# EAGLE design M651A (EAGLE 6.6.0)
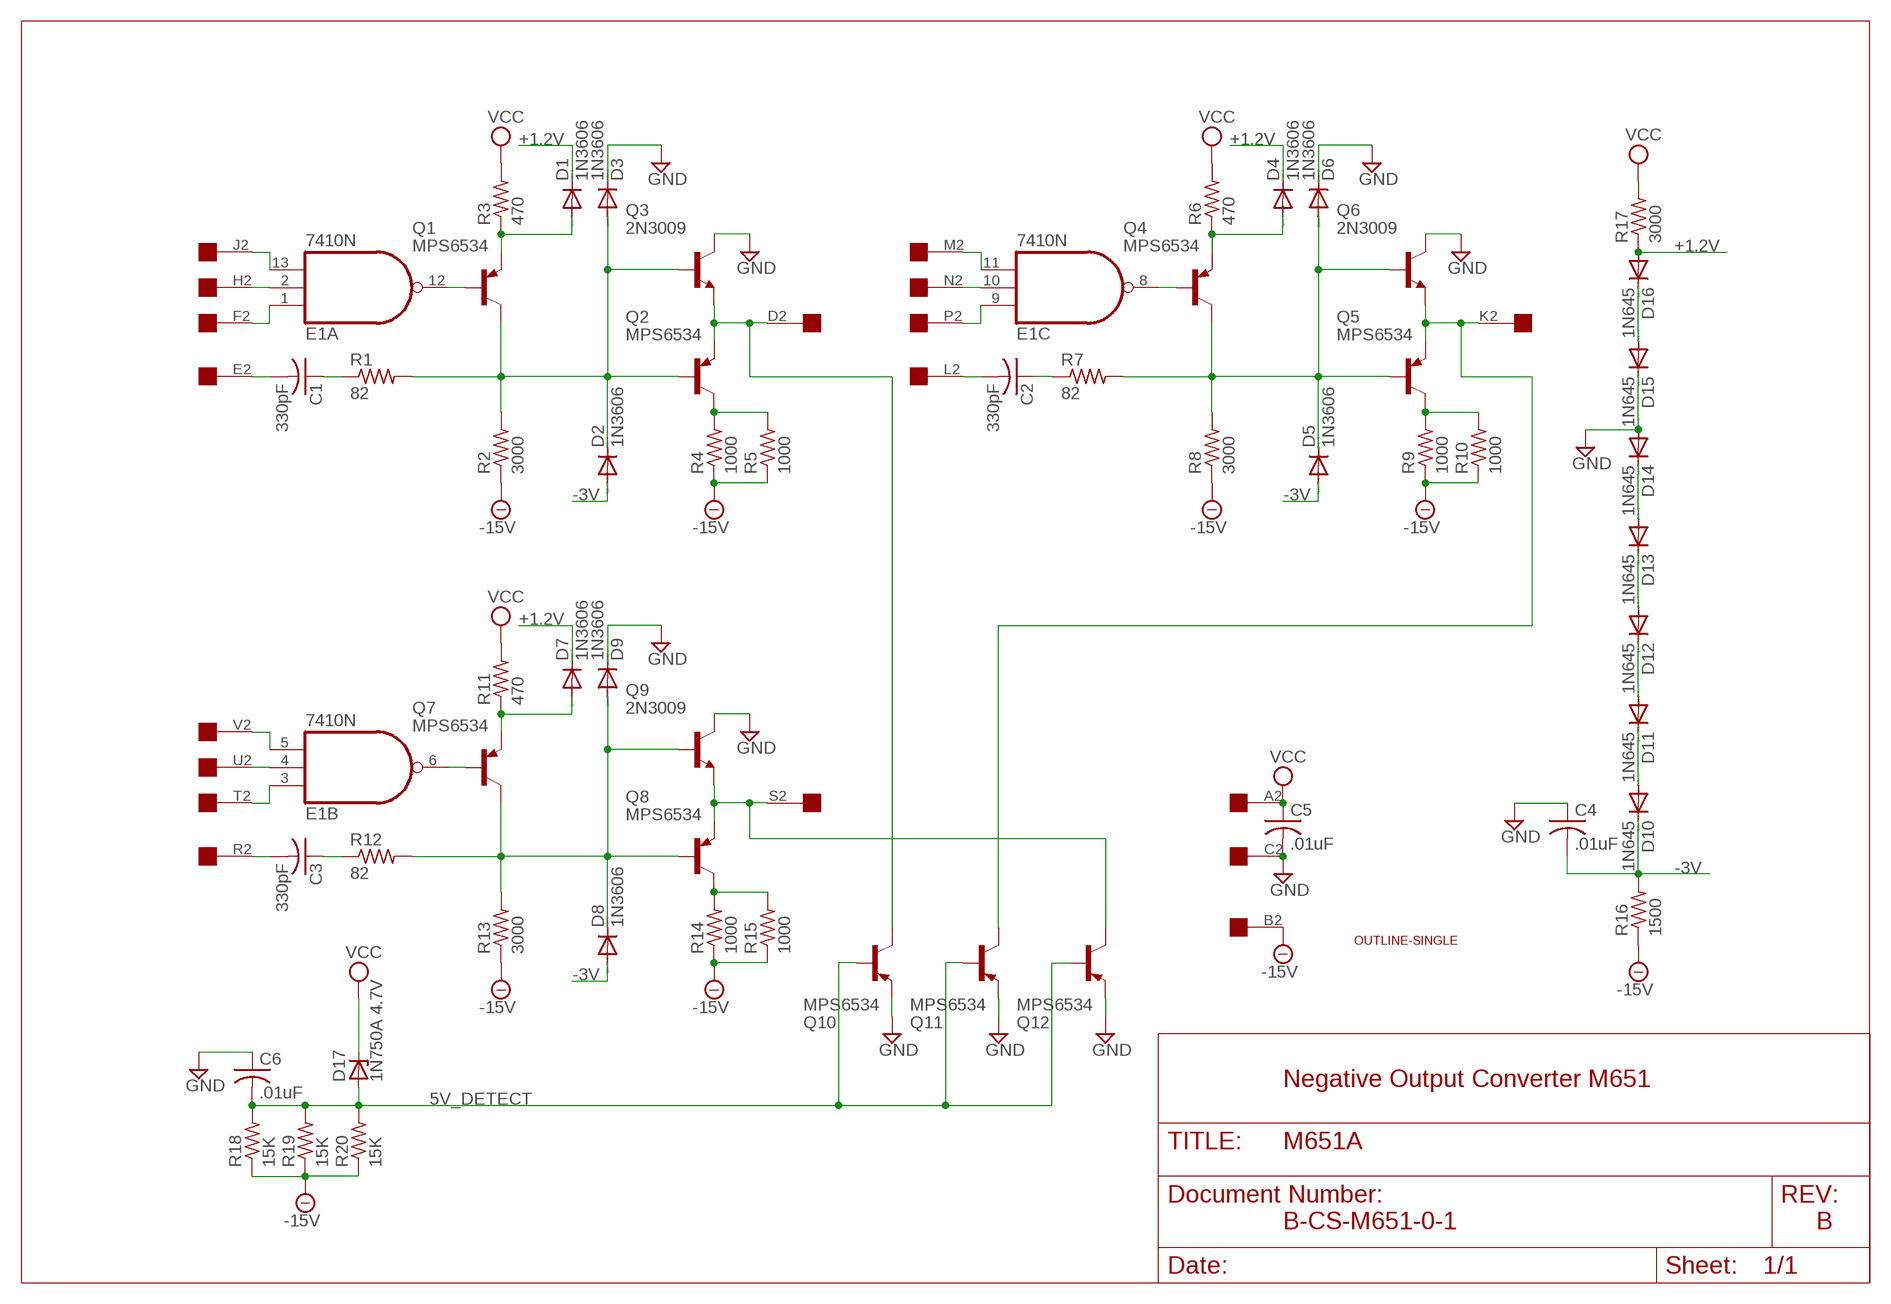
[diagram p0: schematic, sheet 1]

## Parts
C1  330pF  C-US050-025X075  [C050-025X075]
C2  330pF  C-US050-025X075  [C050-025X075]
C3  330pF  C-US050-025X075  [C050-025X075]
C4  .01uF  C-US050-025X075  [C050-025X075]
C5  .01uF  C-US050-025X075  [C050-025X075]
C6  .01uF  C-US050-025X075  [C050-025X075]
D1  1N3606  1N4148DO35-10  [DO35-10]
D2  1N3606  1N4148DO35-10  [DO35-10]
D3  1N3606  1N4148DO35-10  [DO35-10]
D4  1N3606  1N4148DO35-10  [DO35-10]
D5  1N3606  1N4148DO35-10  [DO35-10]
D6  1N3606  1N4148DO35-10  [DO35-10]
D7  1N3606  1N4148DO35-10  [DO35-10]
D8  1N3606  1N4148DO35-10  [DO35-10]
D9  1N3606  1N4148DO35-10  [DO35-10]
D10  1N645  1N4148DO35-10  [DO35-10]
D11  1N645  1N4148DO35-10  [DO35-10]
D12  1N645  1N4148DO35-10  [DO35-10]
D13  1N645  1N4148DO35-10  [DO35-10]
D14  1N645  1N4148DO35-10  [DO35-10]
D15  1N645  1N4148DO35-10  [DO35-10]
D16  1N645  1N4148DO35-10  [DO35-10]
D17  1N750A 4.7V  ZENER-DIODEDO35Z10  [DO35Z10]
E1  7410N  [DIL14]
Q1  MPS6534  2N5415  [TO39]
Q2  MPS6534  2N5415  [TO39]
Q3  2N3009  2N2219  [TO5]
Q4  MPS6534  2N5415  [TO39]
Q5  MPS6534  2N5415  [TO39]
Q6  2N3009  2N2219  [TO5]
Q7  MPS6534  2N5415  [TO39]
Q8  MPS6534  2N5415  [TO39]
Q9  2N3009  2N2219  [TO5]
Q10  MPS6534  2N5415  [TO39]
Q11  MPS6534  2N5415  [TO39]
Q12  MPS6534  2N5415  [TO39]
R1  82  R-US_0207/10  [0207/10]
R2  3000  R-US_0207/10  [0207/10]
R3  470  R-US_0207/10  [0207/10]
R4  1000  R-US_0207/10  [0207/10]
R5  1000  R-US_0207/10  [0207/10]
R6  470  R-US_0207/10  [0207/10]
R7  82  R-US_0207/10  [0207/10]
R8  3000  R-US_0207/10  [0207/10]
R9  1000  R-US_0207/10  [0207/10]
R10  1000  R-US_0207/10  [0207/10]
R11  470  R-US_0207/10  [0207/10]
R12  82  R-US_0207/10  [0207/10]
R13  3000  R-US_0207/10  [0207/10]
R14  1000  R-US_0207/10  [0207/10]
R15  1000  R-US_0207/10  [0207/10]
R16  1500  R-US_0207/10  [0207/10]
R17  3000  R-US_0207/10  [0207/10]
R18  15K  R-US_0207/10  [0207/10]
R19  15K  R-US_0207/10  [0207/10]
R20  15K  R-US_0207/10  [0207/10]
U$1  OUTLINE-SINGLE  [SINGLE]
U$3  EDGE-1  [EDGE-CON1]

## Nets
5V_DETECT: C6.2 D17.A Q10.2(B) Q11.2(B) Q12.2(B) R18.2 R19.2 R20.2
+1.2V [Supply]: D1.C D4.C D7.C D16.A R17.1
-3V [Supply]: C4.2 D2.A D5.A D8.A D10.C R16.2
-15V: R2.1 R4.1 R5.1 R8.1 R9.1 R10.1 R13.1 R14.1 R15.1 R16.1 R18.1 R19.1 R20.1 U$3.B2
GND [Supply]: C4.1 C5.2 C6.1 D3.C D6.C D9.C D14.A D15.C Q3.3(C) Q6.3(C) Q9.3(C) Q10.1(E) Q11.1(E) Q12.1(E) U$3.C2
N$1: E1.2(A:I1) U$3.H2
N$2: C1.2 U$3.E2
N$3: C1.1 R1.1
N$4: E1.12(A:O) Q1.2(B)
N$5: D1.A Q1.1(E) R3.1
N$6: D2.C D3.A Q1.3(C) Q2.2(B) Q3.2(B) R1.2 R2.2
N$7: Q2.1(E) Q3.1(E) Q10.3(C) U$3.D2
N$8: Q2.3(C) R4.2 R5.2
N$9: E1.9(C:I0) U$3.P2
N$10: E1.11(C:I2) U$3.M2
N$11: E1.10(C:I1) U$3.N2
N$12: E1.8(C:O) Q4.2(B)
N$13: D4.A Q4.1(E) R6.1
N$14: E1.1(A:I0) U$3.F2
N$15: E1.13(A:I2) U$3.J2
N$16: C2.2 U$3.L2
N$17: C2.1 R7.1
N$18: D5.C D6.A Q4.3(C) Q5.2(B) Q6.2(B) R7.2 R8.2
N$19: Q5.1(E) Q6.1(E) Q11.3(C) U$3.K2
N$20: Q5.3(C) R9.2 R10.2
N$21: E1.3(B:I0) U$3.T2
N$22: E1.5(B:I2) U$3.V2
N$23: E1.4(B:I1) U$3.U2
N$24: E1.6(B:O) Q7.2(B)
N$25: D7.A Q7.1(E) R11.1
N$26: C3.2 U$3.R2
N$27: C3.1 R12.1
N$28: D8.C D9.A Q7.3(C) Q8.2(B) Q9.2(B) R12.2 R13.2
N$29: Q8.1(E) Q9.1(E) Q12.3(C) U$3.S2
N$30: Q8.3(C) R14.2 R15.2
N$32 [Supply]: D10.A D11.C
N$33 [Supply]: D11.A D12.C
N$34 [Supply]: D12.A D13.C
N$35 [Supply]: D13.A D14.C
N$37 [Supply]: D15.A D16.C
VCC [Supply]: C5.1 D17.C R3.2 R6.2 R11.2 R17.2 U$3.A2

## Notes on the sheet
- Negative Output Converter M651
- B-CS-M651-0-1 | B

## Power pins joined to a net without a drawn wire
GND: E1.7(P:GND)
VCC: E1.14(P:VCC)

## Library data of the parts
C1-C6 = rcl:C-US: CAPACITOR, American symbol
D1-D16 = diode:1N4148: DIODE high speed (Philips)
D17 = diode:ZENER-DIODE: Z-Diode
E1 = 74xx-us:74*10: Triple 3-input NAND gate
Q1 Q2 Q4 Q5 Q7 Q8 Q10-Q12 = transistor-pnp:2N5415*: PNP Transistror
Q3 Q6 Q9 = transistor-npn:2N2219: NPN Transistor
R1-R20 = rcl:R-US_: RESISTOR, American symbol
U$1 = dec-con:OUTLINE-*: Board outlines for DEC boards.
U$3 = dec-con:EDGE-1: Single-Sided DEC Edge Connector -- (side 2)

## Net classes
1 Supply: width 0.813 mm

## Board
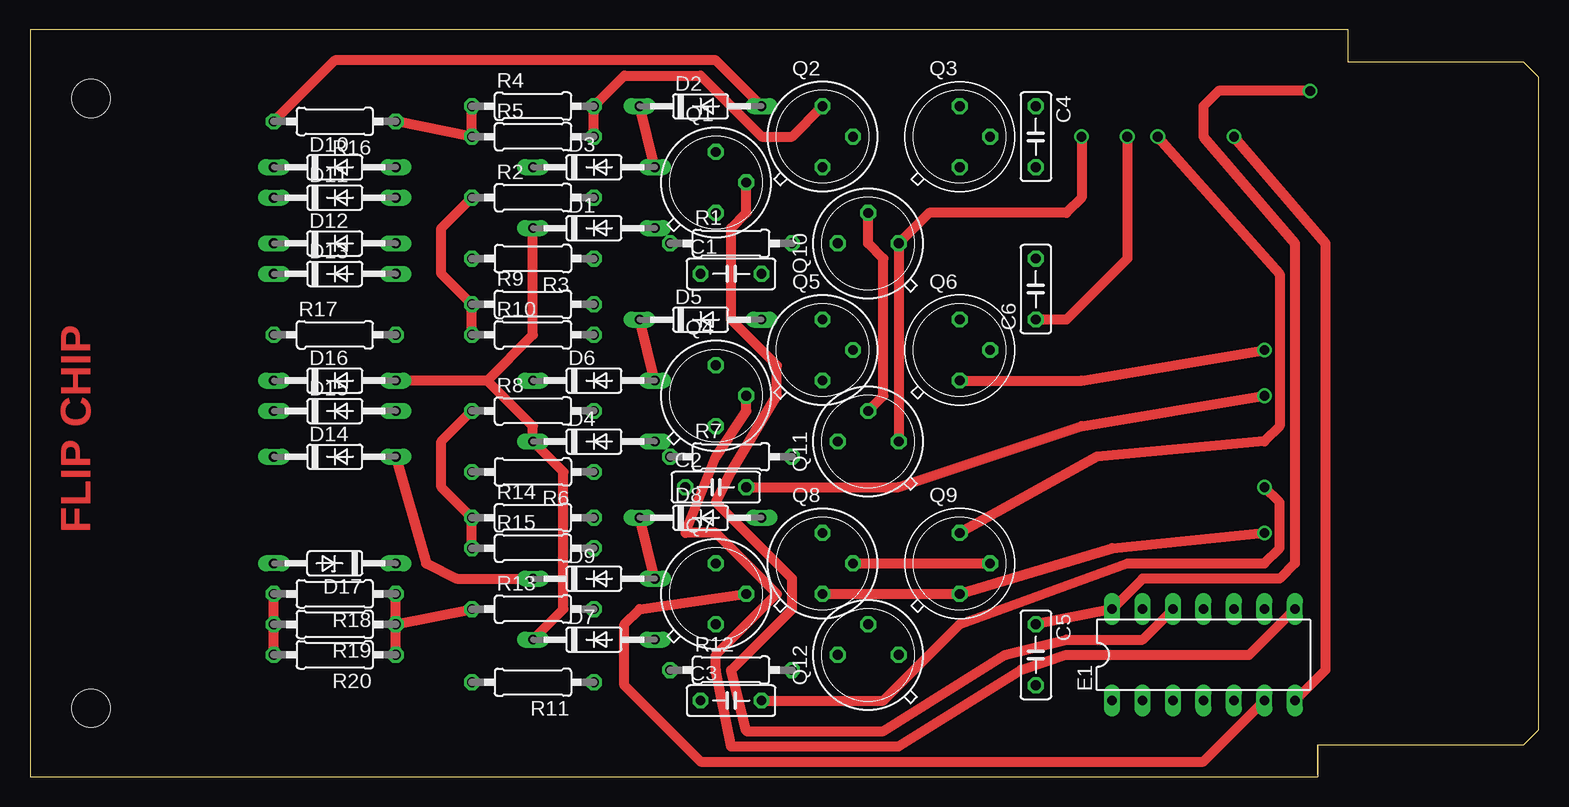
[diagram p1: board, top side]
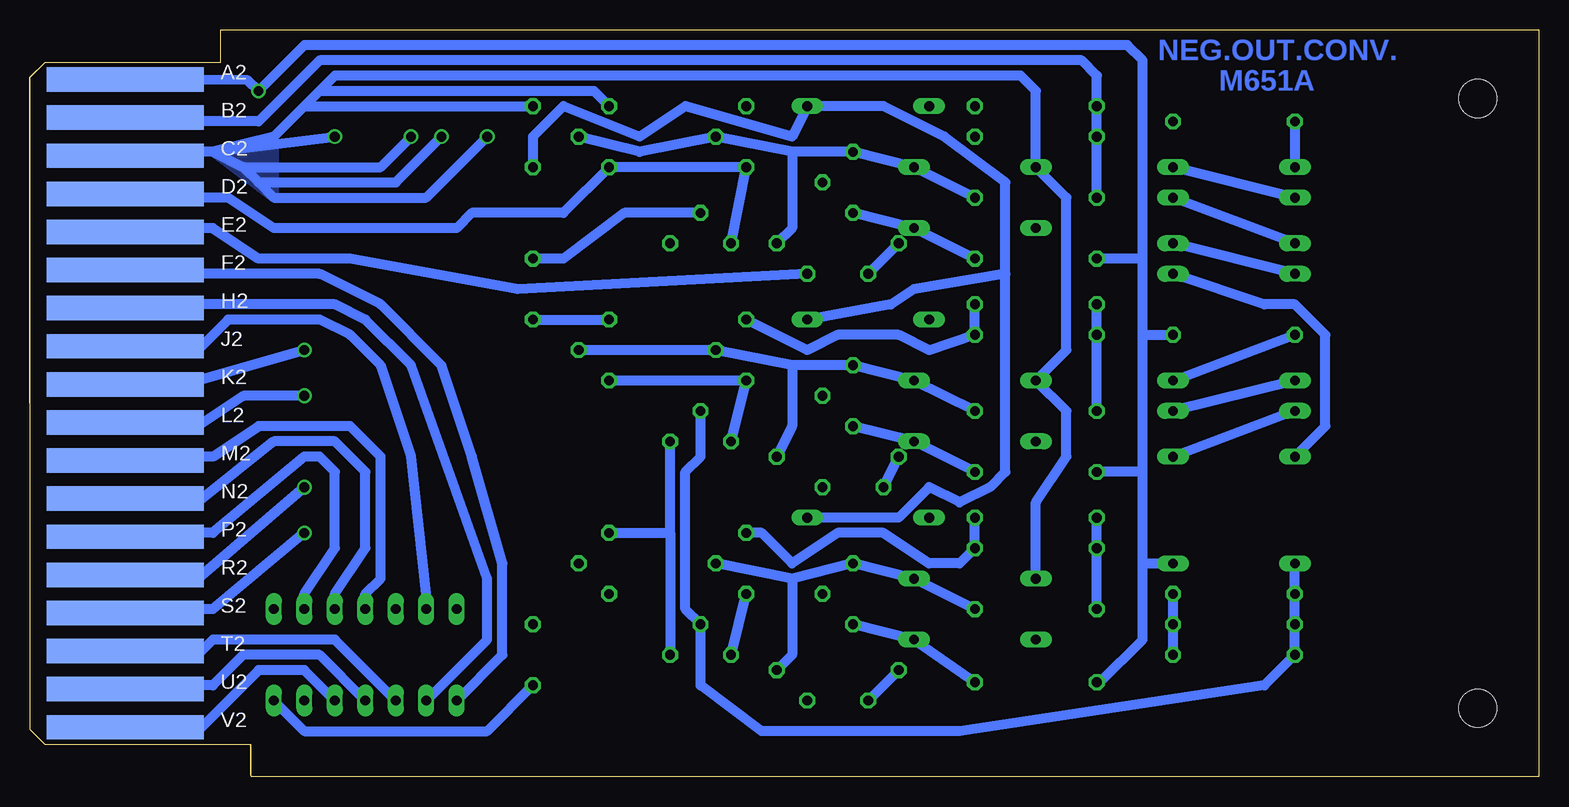
[diagram p2: board, bottom side, seen from below]

Size 125.73 x 62.23 mm. Coordinates in mm from the lower left corner, seen from the top.
Copper layers (1+16): Top 0.035mm / dielectric 1.5mm / Bottom 0.035mm
Design rules "16mils": minimum track width 16mil, minimum drill 32mil, track to track 15mil, track to pad 10mil, pad to pad 10mil, via to via 10mil, smd to smd 10mil, copper to edge 13mil, drill to drill 10mil, minimum pad ring 10mil, minimum via ring 8mil, stop-mask expansion 0mil, vias tented up to drill 0mil, thermal gap 10mil

### Footprints (pad centres in the part's own frame; a part is rotated, then mirrored left to right if it is on the bottom)
C050-025X075 = drill 0.813 octagon: 1 -2.54,0; 2 2.54,0
DO35-10 = drill 0.813 long: A 5.08,0; C -5.08,0
DO35Z10 = drill 0.813 long: A 5.08,0; C -5.08,0
DIL14 = drill 0.813 long: 1 -7.62,-3.81; 2 -5.08,-3.81; 3 -2.54,-3.81; 4 0,-3.81; 5 2.54,-3.81; 6 5.08,-3.81; 7 7.62,-3.81; 8 7.62,3.81; 9 5.08,3.81; 10 2.54,3.81; 11 0,3.81; 12 -2.54,3.81; 13 -5.08,3.81; 14 -7.62,3.81
TO39 = drill 0.813 octagon: 1 0,-2.54; 2 2.54,0; 3 0,2.54
TO5 = drill 0.813 octagon: 1 0,-2.54; 2 2.54,0; 3 0,2.54
0207/10 = drill 0.813 octagon: 1 -5.08,0; 2 5.08,0
SINGLE = hole 3.175: 120.65,56.515; 120.65,5.715
EDGE-CON1 = smd 13.106 x 2.032 bottom: A2 7.938,4.128; B2 7.938,7.303; C2 7.938,10.477; D2 7.938,13.652; E2 7.938,16.828; F2 7.938,20.003; H2 7.938,23.177; J2 7.938,26.352; K2 7.938,29.527; L2 7.938,32.703; M2 7.938,35.877; N2 7.938,39.053; P2 7.938,42.227; R2 7.938,45.403; S2 7.938,48.578; T2 7.938,51.752; U2 7.938,54.928; V2 7.938,58.102

### Placement (x,y rotation side)
C1  58.42,41.91 0 top
C2  57.15,24.13 0 top
C3  58.42,6.35 0 top
C4  83.82,53.34 270 top
C5  83.82,10.16 270 top
C6  83.82,40.64 90 top
D1  46.99,45.72 0 top
D2  55.88,55.88 0 top
D3  46.99,50.8 0 top
D4  46.99,27.94 0 top
D5  55.88,38.1 0 top
D6  46.99,33.02 0 top
D7  46.99,11.43 0 top
D8  55.88,21.59 0 top
D9  46.99,16.51 0 top
D10  25.4,50.8 0 top
D11  25.4,48.26 0 top
D12  25.4,44.45 0 top
D13  25.4,41.91 0 top
D14  25.4,26.67 0 top
D15  25.4,30.48 0 top
D16  25.4,33.02 0 top
D17  25.4,17.78 180 top
E1  97.79,10.16 0 top
Q1  57.15,49.53 0 top
Q2  66.04,53.34 0 top
Q3  77.47,53.34 0 top
Q4  57.15,31.75 0 top
Q5  66.04,35.56 0 top
Q6  77.47,35.56 0 top
Q7  57.15,15.24 0 top
Q8  66.04,17.78 0 top
Q9  77.47,17.78 0 top
Q10  69.85,44.45 90 top
Q11  69.85,27.94 90 top
Q12  69.85,10.16 90 top
R1  58.42,44.45 0 top
R2  41.91,48.26 0 top
R3  41.91,43.18 180 top
R4  41.91,55.88 0 top
R5  41.91,53.34 0 top
R6  41.91,25.4 180 top
R7  58.42,26.67 0 top
R8  41.91,30.48 0 top
R9  41.91,39.37 0 top
R10  41.91,36.83 0 top
R11  41.91,7.87 180 top
R12  58.42,8.89 0 top
R13  41.91,13.97 0 top
R14  41.91,21.59 0 top
R15  41.91,19.05 0 top
R16  25.4,54.61 180 top
R17  25.4,36.83 0 top
R18  25.4,15.24 180 top
R19  25.4,12.7 180 top
R20  25.4,10.16 180 top
U$1  125.73,62.23 180 top
U$2  [FLIPCHIP]  0,1.27 0 top
U$3  125.73,62.23 180 top

### Tracks (layer width: path | path; a pad name or v marks a point on that pad's centre or on a via)
5V_DETECT
  Top 0.813: R20.2 R19.2 R18.2 | Q11.2 71.12,31.75 71.12,43.18 69.85,44.45 Q10.2
  Bottom 0.813: D17.A R18.2 R19.2 R20.2 22.86,7.62 48.26,3.81 64.77,3.81 69.85,7.62 Q12.2 71.12,13.97 71.12,25.4 69.85,26.67 Q11.2 | Q10.2 76.2,46.99 81.28,43.18 C6.2
+1.2V
  Top 0.813: 38.1,33.02 D16.A | 38.1,33.02 41.91,29.21 D4.C 44.45,25.4 44.45,13.97 D7.C | D1.C 41.91,36.83 38.1,33.02
  Bottom 0.813: D16.A R17.1
-3V
  Top 0.813: R16.2 25.4,59.69 57.15,59.69 D2.A
  Bottom 0.813: R16.2 D10.C | D8.A 53.34,21.59 50.8,24.13 48.26,22.86 45.72,24.13 44.45,25.4 44.45,41.91 | D5.A 53.98,39.37 52.07,40.64 44.45,41.91 | 44.45,41.91 44.45,49.53 49.53,53.34 54.61,55.88 D2.A 62.23,53.34 71.12,55.88 74.93,53.34 81.28,55.88 83.82,53.34 C4.2
-15V
  Top 0.813: R19.1 R13.1 | R20.1 R19.1 | R19.1 R18.1 | R15.1 R14.1 34.29,24.13 34.29,27.94 R8.1 | R10.1 R9.1 34.29,41.91 34.29,45.72 R2.1 | R4.1 R5.1 R16.1
  Bottom 0.813: R20.1 R19.1 R18.1 | R13.1 R15.1 R14.1 | R8.1 R10.1 R9.1 | R2.1 R5.1 R4.1 36.83,58.42 38.1,59.69 101.6,59.69 106.68,54.61 116.84,54.61 U$3.B2
GND  (via drill 0.81)
  Top 0.813: Q11.1 Q10.1 74.93,46.99 86.36,46.99 87.63,48.26 v87.63,53.34 | C6.1 86.36,38.1 91.44,43.18 v91.44,53.34 | v93.98,53.34 104.14,41.91 104.14,29.21 102.87,27.94 88.9,26.67 Q9.3 | v100.33,53.34 107.95,44.45 107.95,8.89 E1.7 | D14.A 33.02,17.78 35.56,16.51 D9.C
  Bottom 0.813: U$3.C2 117.17,51.74 116.84,52.07 110.49,52.07 | 110.49,52.07 107.95,50.8 | 107.95,50.8 106.68,49.53 | 106.68,49.53 105.41,48.26 92.71,48.26 v87.63,53.34 | 102.87,55.88 C4.1 | 102.87,55.88 105.41,53.34 110.49,52.07 | Q3.3 78.74,57.15 101.6,57.15 | 101.6,57.15 102.87,55.88 | v91.44,53.34 95.25,49.53 106.68,49.53 | v93.98,53.34 96.52,50.8 107.95,50.8 | 110.49,52.07 v100.33,53.34 | D15.C D14.A | E1.7 102.87,3.81 87.63,3.81 C5.2 | 72.39,20.32 Q12.1 | 72.39,20.32 Q11.1 | D9.C 41.91,22.86 39.37,26.67 39.37,30.48 D6.C 39.37,35.56 39.37,48.26 D3.C 41.91,57.15 43.18,58.42 100.33,58.42 101.6,57.15 | Q9.3 72.39,20.32 | C6.1 Q6.3
  pour Bottom: 110.49,52.07 105.41,53.34 105.41,48.26
N$1
  Bottom 0.813: E1.2 87.63,11.43 87.63,16.51 93.98,34.29 97.79,38.1 100.33,39.37 116.84,39.37 U$3.H2
N$2
  Bottom 0.813: U$3.E2 116.84,45.72 110.49,45.72 106.68,43.18 99.06,43.18 85.09,40.64 C1.2
N$3
  Bottom 0.813: R1.1 C1.1
N$4
  Top 0.813: E1.12 92.71,11.43 86.36,11.43 81.28,10.16 71.12,3.81 59.69,3.81 58.42,8.89 63.5,13.97 63.5,16.51 57.15,22.86 58.42,25.4 62.23,31.75 62.23,34.29 58.42,38.1 58.42,45.72 59.69,46.99 Q1.2
N$5
  Bottom 0.813: Q1.1 D1.A R3.1
N$6
  Top 0.813: D3.A D2.C
  Bottom 0.813: R2.2 D3.A Q1.3 62.23,52.07 | 62.23,52.07 Q2.2 74.93,52.07 Q3.2 | R1.2 62.23,45.72 62.23,52.07
N$7
  Bottom 0.813: U$3.D2 117.14,48.56 116.84,48.26 109.22,48.26 105.41,45.72 90.17,45.72 88.9,46.99 81.28,46.99 Q3.1 Q2.1 Q10.3
N$8
  Top 0.813: R5.2 R4.2 49.53,58.42 55.88,58.42 60.96,53.34 63.5,53.34 Q2.3
N$9
  Bottom 0.813: E1.9 102.87,15.24 100.33,19.05 100.33,25.4 101.6,26.67 102.87,26.67 110.49,20.32 116.84,20.32 U$3.P2
N$10
  Bottom 0.813: E1.11 97.79,15.24 96.52,16.51 96.52,26.67 99.06,29.21 106.68,29.21 110.49,26.67 116.84,26.67 U$3.M2
N$11
  Bottom 0.813: U$3.N2 116.84,22.86 111.76,22.86 105.41,27.94 100.33,27.94 97.79,25.4 97.79,19.05 100.33,15.24 E1.10
N$12
  Top 0.813: E1.8 101.6,10.16 86.36,10.16 82.55,8.89 72.39,2.54 58.42,2.54 57.15,8.89 57.15,10.16 62.23,15.24 57.15,20.32 54.61,20.32 57.15,26.67 59.69,30.48 Q4.2
N$13
  Bottom 0.813: Q4.1 D4.A R6.1
N$14
  Bottom 0.813: E1.1 86.36,10.16 86.36,17.78 88.9,26.67 91.44,34.29 96.52,39.37 101.6,41.91 116.84,41.91 U$3.F2
N$15
  Bottom 0.813: U$3.J2 116.84,35.56 111.76,35.56 109.22,38.1 101.6,38.1 99.06,36.83 96.52,34.29 93.98,26.67 92.71,15.24 E1.13
N$16  (via drill 0.81)
  Top 0.813: C2.2 72.39,24.13 87.63,29.21 v102.87,31.75
  Bottom 0.813: U$3.L2 116.84,29.21 111.76,29.21 107.95,31.75 v102.87,31.75
N$17
  Bottom 0.813: C2.1 R7.1
N$18
  Top 0.813: D6.A D5.C
  Bottom 0.813: Q6.2 Q5.2 62.23,34.29 | 62.23,34.29 Q4.3 D6.A R8.2 | R7.2 62.23,29.21 62.23,34.29
N$19  (via drill 0.81)
  Top 0.813: Q6.1 87.63,33.02 v102.87,35.56
  Bottom 0.813: U$3.K2 116.84,33.02 111.76,33.02 v102.87,35.56 | Q11.3 Q5.1 Q6.1
N$20
  Bottom 0.813: Q5.3 60.96,35.56 58.42,36.83 53.34,36.83 50.8,35.56 R10.2 R9.2
N$21
  Bottom 0.813: E1.3 100.33,11.43 110.49,11.43 111.76,10.16 116.84,10.16 U$3.T2
N$22
  Bottom 0.813: E1.5 102.87,8.89 106.68,8.89 111.76,3.81 116.84,3.81 U$3.V2
N$23
  Bottom 0.813: U$3.U2 116.84,7.62 110.49,7.62 107.95,10.16 101.6,10.16 E1.4
N$24
  Top 0.813: E1.6 97.79,1.27 55.88,1.27 49.53,7.62 49.53,12.7 50.8,13.97 Q7.2
N$25
  Bottom 0.813: Q7.1 D7.A R11.1
N$26  (via drill 0.81)
  Top 0.813: v102.87,24.13 104.14,22.86 104.14,19.05 102.87,17.78 91.44,17.78 77.47,12.7 71.12,6.35 C3.2
  Bottom 0.813: U$3.R2 116.84,16.51 111.76,16.51 v102.87,24.13
N$27
  Bottom 0.813: R12.1 C3.1
N$28
  Top 0.813: D9.A D8.C | Q8.2 Q9.2
  Bottom 0.813: R13.2 D9.A Q7.3 62.23,16.51 | 62.23,16.51 Q8.2 | R12.2 62.23,10.16 62.23,16.51
N$29  (via drill 0.81)
  Top 0.813: Q8.1 Q9.1 90.17,19.05 v102.87,20.32
  Bottom 0.813: U$3.S2 116.84,13.97 110.49,13.97 v102.87,20.32 | Q12.3 Q8.1
N$30
  Bottom 0.813: R14.2 R15.2 48.26,17.78 50.8,17.78 54.61,20.32 58.42,20.32 62.23,17.78 64.77,20.32 Q8.3
N$32
  Bottom 0.813: D11.C D10.A
N$33
  Bottom 0.813: D12.C D11.A
N$34
  Bottom 0.813: D13.C D12.A
N$35
  Bottom 0.813: D14.C 17.78,29.21 17.78,36.83 20.32,39.37 22.86,39.37 D13.A
N$37
  Bottom 0.813: D16.C D15.A
VCC  (via drill 0.81)
  Top 0.813: C5.1 E1.14 92.71,16.51 104.14,16.51 105.41,17.78 105.41,44.45 97.79,53.34 97.79,55.88 99.06,57.15 v106.68,57.15
  Bottom 0.813: U$3.A2 107.57,58.04 v106.68,57.15 102.87,60.96 34.29,60.96 33.02,59.69 33.02,43.18 | 33.02,43.18 R3.2 | R11.2 36.58,7.87 33.02,11.43 33.02,17.78 | 33.02,17.78 D17.C | 33.02,17.78 33.02,25.4 | 33.02,25.4 33.02,36.83 | 33.02,36.83 33.02,43.18 | 33.02,36.83 R17.2 | 33.02,25.4 R6.2

### Text on the board
Bottom: NEG.OUT.CONV. | M651A